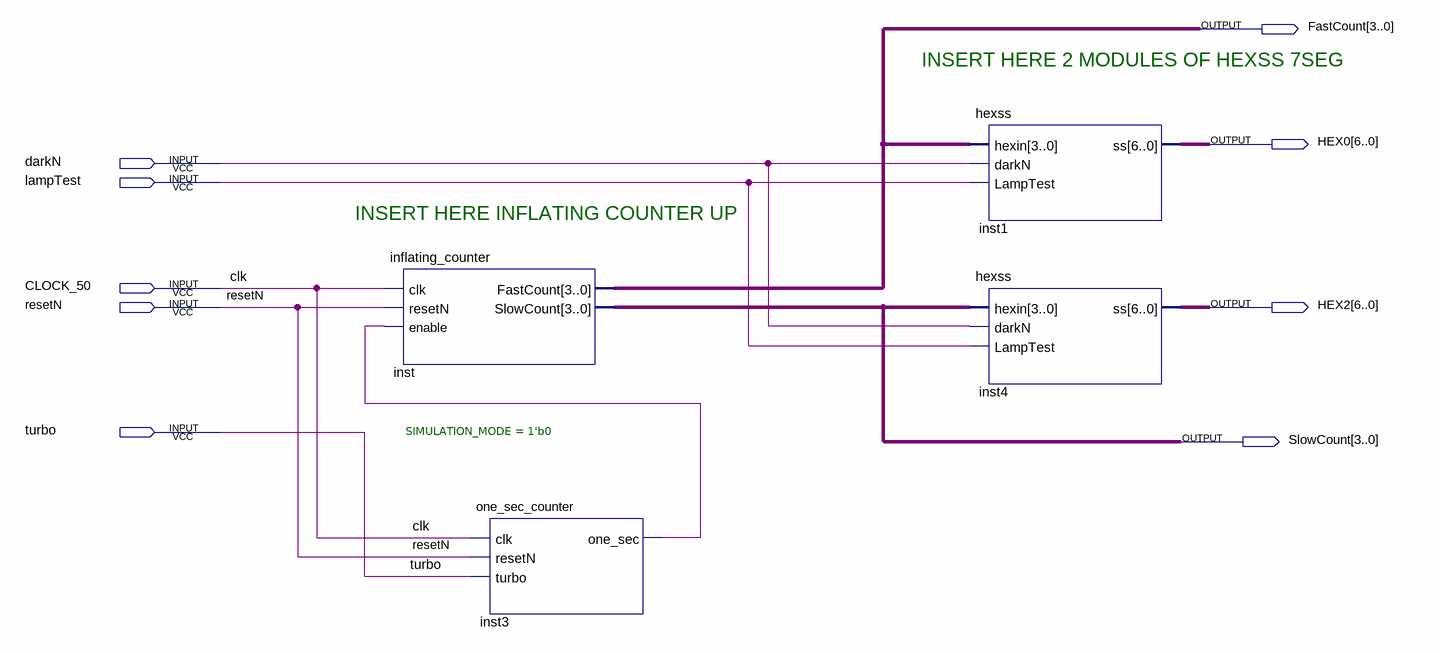
[diagram p0: schematic sheet]
// Quartus schematic inflating_cnt_top.bdf as structural Verilog: 4 symbols, 9 pins
module inflating_cnt_top (
  input  darkN,
  input  lampTest,
  input  CLOCK_50,
  input  resetN,
  input  turbo,
  output [3:0] FastCount,
  output [6:0] HEX0,
  output [6:0] HEX2,
  output [3:0] SlowCount
);

  wire inst3_one_sec;

  inflating_counter inst (
    .clk(CLOCK_50), .resetN(resetN), .enable(inst3_one_sec), .FastCount(FastCount), .SlowCount(SlowCount));
  one_sec_counter #(.SIMULATION_MODE(1'b0)) inst3 (
    .clk(CLOCK_50), .resetN(resetN), .turbo(turbo), .one_sec(inst3_one_sec));
  hexss inst1 (.hexin(FastCount), .darkN(darkN), .LampTest(lampTest), .ss(HEX0));
  hexss inst4 (.hexin(SlowCount), .darkN(darkN), .LampTest(lampTest), .ss(HEX2));

  // Other names for the same wires on the sheet: clk = CLOCK_50

  // Notes on the sheet:
  //   INSERT HERE 2 MODULES OF HEXSS 7SEG
  //   INSERT HERE INFLATING COUNTER UP
endmodule
